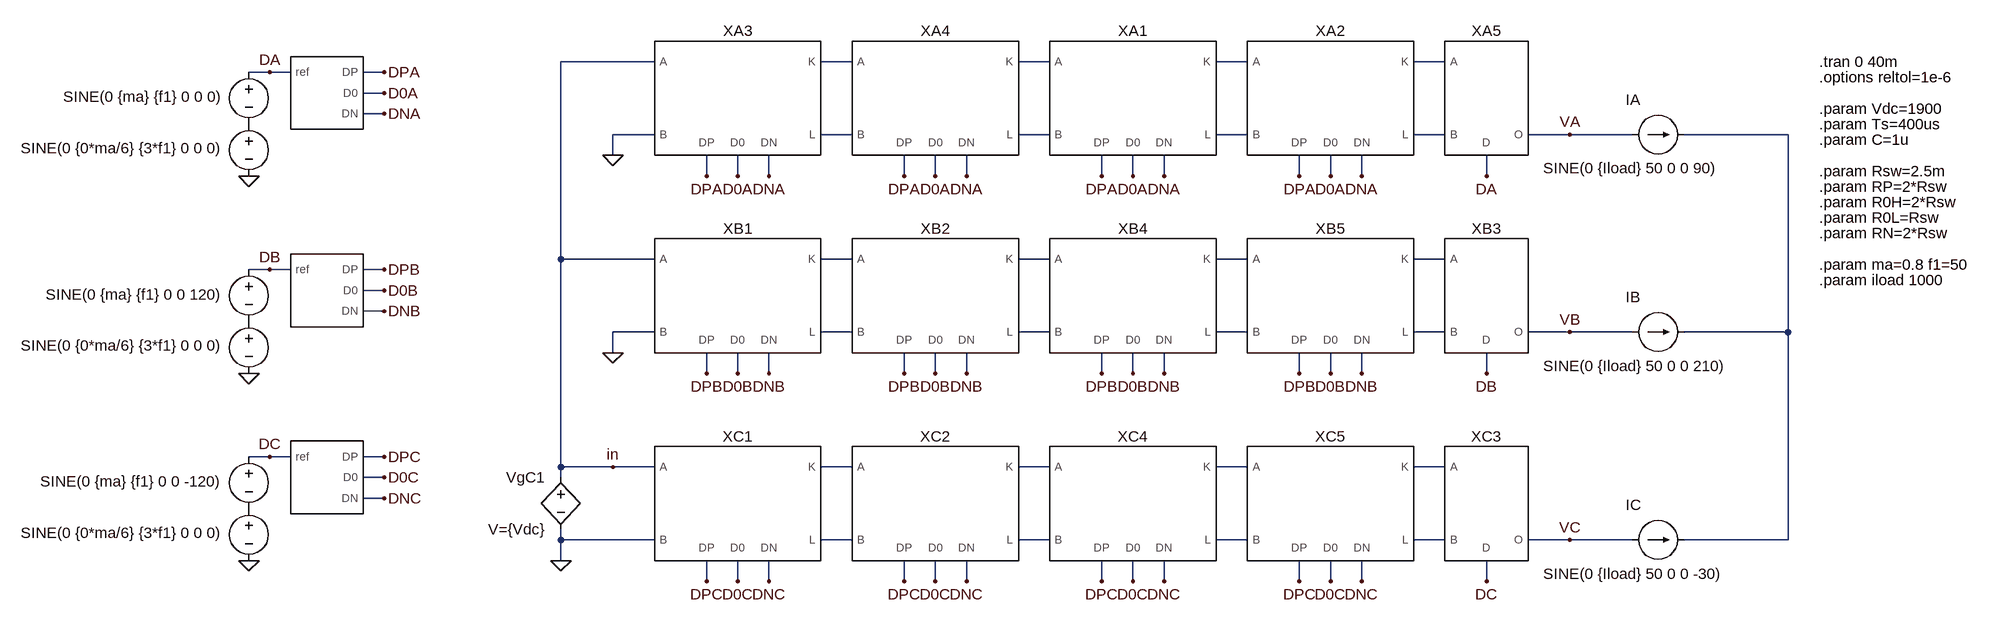
[diagram p0: schematic STATCOM.asc]
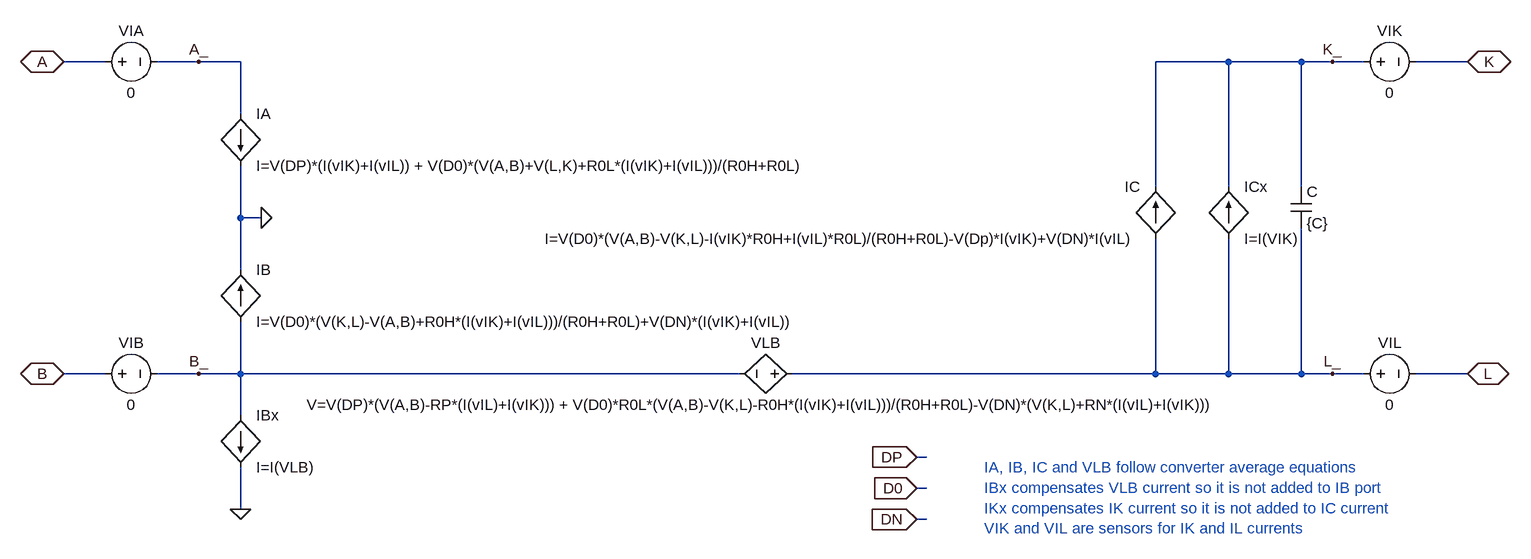
[diagram p1: sub-circuit pn_average_model.asc]
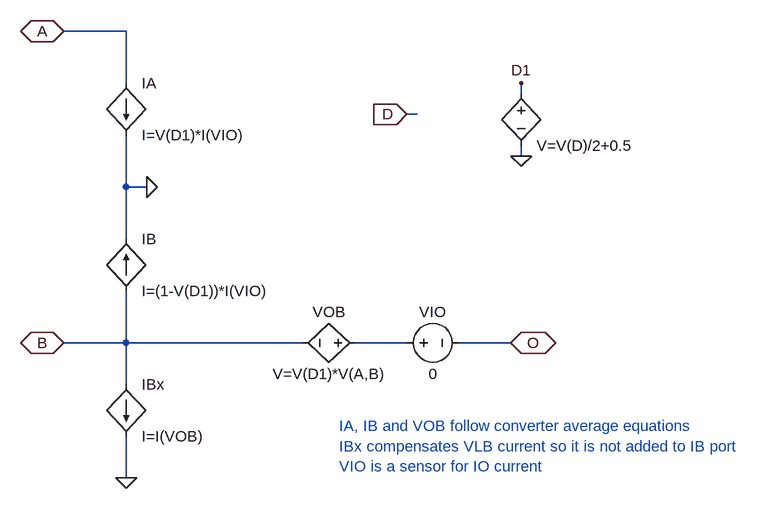
[diagram p2: sub-circuit 2l_average_model.asc]
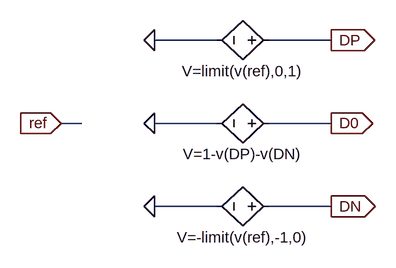
[diagram p3: sub-circuit pn_average_modulator.asc]
STATCOM.asc, the LTspice schematic file:
Version 4
SHEET 1 4356 1844
WIRE 1328 -672 1184 -672
WIRE 1632 -672 1584 -672
WIRE 1936 -672 1888 -672
WIRE 2240 -672 2192 -672
WIRE 2544 -672 2496 -672
WIRE 736 -656 704 -656
WIRE 768 -656 736 -656
WIRE 912 -656 880 -656
WIRE 912 -624 880 -624
WIRE 912 -592 880 -592
WIRE 1328 -560 1264 -560
WIRE 1632 -560 1584 -560
WIRE 1936 -560 1888 -560
WIRE 2240 -560 2192 -560
WIRE 2544 -560 2496 -560
WIRE 2736 -560 2672 -560
WIRE 2832 -560 2736 -560
WIRE 3072 -560 2912 -560
WIRE 1264 -528 1264 -560
WIRE 1408 -496 1408 -528
WIRE 1456 -496 1456 -528
WIRE 1504 -496 1504 -528
WIRE 1712 -496 1712 -528
WIRE 1760 -496 1760 -528
WIRE 1808 -496 1808 -528
WIRE 2016 -496 2016 -528
WIRE 2064 -496 2064 -528
WIRE 2112 -496 2112 -528
WIRE 2320 -496 2320 -528
WIRE 2368 -496 2368 -528
WIRE 2416 -496 2416 -528
WIRE 2608 -496 2608 -528
WIRE 1184 -368 1184 -672
WIRE 1328 -368 1184 -368
WIRE 1632 -368 1584 -368
WIRE 1936 -368 1888 -368
WIRE 2240 -368 2192 -368
WIRE 2544 -368 2496 -368
WIRE 736 -352 704 -352
WIRE 768 -352 736 -352
WIRE 912 -352 880 -352
WIRE 912 -320 880 -320
WIRE 912 -288 880 -288
WIRE 1328 -256 1264 -256
WIRE 1632 -256 1584 -256
WIRE 1936 -256 1888 -256
WIRE 2240 -256 2192 -256
WIRE 2544 -256 2496 -256
WIRE 2736 -256 2672 -256
WIRE 2832 -256 2736 -256
WIRE 3072 -256 3072 -560
WIRE 3072 -256 2912 -256
WIRE 1264 -224 1264 -256
WIRE 1408 -192 1408 -224
WIRE 1456 -192 1456 -224
WIRE 1504 -192 1504 -224
WIRE 1712 -192 1712 -224
WIRE 1760 -192 1760 -224
WIRE 1808 -192 1808 -224
WIRE 2016 -192 2016 -224
WIRE 2064 -192 2064 -224
WIRE 2112 -192 2112 -224
WIRE 2320 -192 2320 -224
WIRE 2368 -192 2368 -224
WIRE 2416 -192 2416 -224
WIRE 2608 -192 2608 -224
WIRE 736 -64 704 -64
WIRE 768 -64 736 -64
WIRE 912 -64 880 -64
WIRE 1184 -48 1184 -368
WIRE 1264 -48 1184 -48
WIRE 1328 -48 1264 -48
WIRE 1632 -48 1584 -48
WIRE 1936 -48 1888 -48
WIRE 2240 -48 2192 -48
WIRE 2544 -48 2496 -48
WIRE 912 -32 880 -32
WIRE 1184 -32 1184 -48
WIRE 912 0 880 0
WIRE 1184 64 1184 48
WIRE 1328 64 1184 64
WIRE 1632 64 1584 64
WIRE 1936 64 1888 64
WIRE 2240 64 2192 64
WIRE 2544 64 2496 64
WIRE 2736 64 2672 64
WIRE 2832 64 2736 64
WIRE 3072 64 3072 -256
WIRE 3072 64 2912 64
WIRE 1184 96 1184 64
WIRE 1408 128 1408 96
WIRE 1456 128 1456 96
WIRE 1504 128 1504 96
WIRE 1712 128 1712 96
WIRE 1760 128 1760 96
WIRE 1808 128 1808 96
WIRE 2016 128 2016 96
WIRE 2064 128 2064 96
WIRE 2112 128 2112 96
WIRE 2320 128 2320 96
WIRE 2368 128 2368 96
WIRE 2416 128 2416 96
WIRE 2608 128 2608 96
FLAG 912 -656 DPA
FLAG 912 -624 D0A
FLAG 912 -592 DNA
FLAG 1408 -496 DPA
FLAG 1456 -496 D0A
FLAG 1504 -496 DNA
FLAG 1264 -528 0
FLAG 1408 -192 DPB
FLAG 1456 -192 D0B
FLAG 1504 -192 DNB
FLAG 1264 -224 0
FLAG 1408 128 DPC
FLAG 1456 128 D0C
FLAG 1504 128 DNC
FLAG 1184 96 0
FLAG 704 -496 0
FLAG 1712 -496 DPA
FLAG 1760 -496 D0A
FLAG 1808 -496 DNA
FLAG 912 -352 DPB
FLAG 912 -320 D0B
FLAG 912 -288 DNB
FLAG 704 -192 0
FLAG 912 -64 DPC
FLAG 912 -32 D0C
FLAG 912 0 DNC
FLAG 704 96 0
FLAG 1712 -192 DPB
FLAG 1760 -192 D0B
FLAG 1808 -192 DNB
FLAG 1712 128 DPC
FLAG 1760 128 D0C
FLAG 1808 128 DNC
FLAG 736 -64 DC
FLAG 736 -352 DB
FLAG 736 -656 DA
FLAG 2608 -496 DA
FLAG 2608 -192 DB
FLAG 2608 128 DC
FLAG 2736 -560 VA
FLAG 2736 -256 VB
FLAG 2736 64 VC
FLAG 2016 -496 DPA
FLAG 2064 -496 D0A
FLAG 2112 -496 DNA
FLAG 2016 -192 DPB
FLAG 2064 -192 D0B
FLAG 2112 -192 DNB
FLAG 2016 128 DPC
FLAG 2064 128 D0C
FLAG 2112 128 DNC
FLAG 2320 -496 DPA
FLAG 2368 -496 D0A
FLAG 2416 -496 DNA
FLAG 2320 -192 DPB
FLAG 2368 -192 D0B
FLAG 2416 -192 DNB
FLAG 2320 128 DPC
FLAG 2368 128 D0C
FLAG 2416 128 DNC
FLAG 1264 -48 in
SYMBOL PN_average_model 1456 -624 R0
SYMATTR InstName XA3
SYMATTR SpiceLine C={4*C} RP={RP/4} R0H={R0H/4} R0L={R0L/4} RN={RN/4}
SYMBOL PN_average_model 1760 -624 R0
SYMATTR InstName XA4
SYMATTR SpiceLine C={3*C} RP={RP/3} R0H={R0H/3} R0L={R0L/3} RN={RN/3}
SYMBOL PN_average_model 1456 -320 R0
SYMATTR InstName XB1
SYMATTR SpiceLine C={4*C} RP={RP/4} R0H={R0H/4} R0L={R0L/4} RN={RN/4}
SYMBOL PN_average_model 1760 -320 R0
SYMATTR InstName XB2
SYMATTR SpiceLine C={3*C} RP={RP/3} R0H={R0H/3} R0L={R0L/3} RN={RN/3}
SYMBOL bv 1184 -48 M0
SYMATTR InstName VgC1
SYMATTR Value V={Vdc}
SYMBOL PN_average_model 1456 0 R0
SYMATTR InstName XC1
SYMATTR SpiceLine C={4*C} RP={RP/4} R0H={R0H/4} R0L={R0L/4} RN={RN/4}
SYMBOL PN_average_model 1760 0 R0
SYMATTR InstName XC2
SYMATTR SpiceLine C={3*C} RP={RP/3} R0H={R0H/3} R0L={R0L/3} RN={RN/3}
SYMBOL voltage 704 -672 M0
WINDOW 0 24 16 Invisible 2
WINDOW 3 39 54 Left 2
SYMATTR InstName V2
SYMATTR Value SINE(0 {ma} {f1} 0 0 0)
SYMBOL voltage 704 -592 M0
WINDOW 0 24 16 Invisible 2
WINDOW 3 39 53 Left 2
SYMATTR InstName V3
SYMATTR Value SINE(0 {0*ma/6} {3*f1} 0 0 0)
SYMBOL voltage 704 -368 M0
WINDOW 0 24 16 Invisible 2
WINDOW 3 39 54 Left 2
SYMATTR InstName V4
SYMATTR Value SINE(0 {ma} {f1} 0 0 120)
SYMBOL voltage 704 -288 M0
WINDOW 0 24 16 Invisible 2
WINDOW 3 39 53 Left 2
SYMATTR InstName V5
SYMATTR Value SINE(0 {0*ma/6} {3*f1} 0 0 0)
SYMBOL voltage 704 -80 M0
WINDOW 0 24 16 Invisible 2
WINDOW 3 39 54 Left 2
SYMATTR InstName V6
SYMATTR Value SINE(0 {ma} {f1} 0 0 -120)
SYMBOL voltage 704 0 M0
WINDOW 0 24 16 Invisible 2
WINDOW 3 39 53 Left 2
SYMATTR InstName V8
SYMATTR Value SINE(0 {0*ma/6} {3*f1} 0 0 0)
SYMBOL 2L_average_model 2608 -640 R0
SYMATTR InstName XA5
SYMBOL 2L_average_model 2608 -336 R0
SYMATTR InstName XB3
SYMBOL 2L_average_model 2608 -16 R0
SYMATTR InstName XC3
SYMBOL PN_average_modulator 816 -624 R0
WINDOW 0 8 -56 Invisible 2
SYMATTR InstName X1
SYMBOL PN_average_modulator 816 -320 R0
WINDOW 0 8 -56 Invisible 2
SYMATTR InstName X3
SYMBOL PN_average_modulator 816 -32 R0
WINDOW 0 8 -56 Invisible 2
SYMATTR InstName X4
SYMBOL current 2832 -560 M90
WINDOW 123 0 0 Left 2
WINDOW 39 0 0 Left 2
WINDOW 3 52 -137 VRight 2
WINDOW 0 -54 -10 VRight 2
SYMATTR Value SINE(0 {Iload} 50 0 0 90)
SYMATTR InstName IA
SYMBOL current 2832 -256 M90
WINDOW 123 0 0 Left 2
WINDOW 39 0 0 Left 2
WINDOW 3 52 -137 VRight 2
WINDOW 0 -54 -10 VRight 2
SYMATTR Value SINE(0 {Iload} 50 0 0 210)
SYMATTR InstName IB
SYMBOL current 2832 64 M90
WINDOW 123 0 0 Left 2
WINDOW 39 0 0 Left 2
WINDOW 3 52 -137 VRight 2
WINDOW 0 -54 -10 VRight 2
SYMATTR Value SINE(0 {Iload} 50 0 0 -30)
SYMATTR InstName IC
SYMBOL PN_average_model 2064 -624 R0
SYMATTR InstName XA1
SYMATTR SpiceLine C={2*C} RP={RP/2} R0H={R0H/2} R0L={R0L/2} RN={RN/2}
SYMBOL PN_average_model 2368 -624 R0
SYMATTR InstName XA2
SYMATTR SpiceLine C={C} RP={RP} R0H={R0H} R0L={R0L} RN={RN}
SYMBOL PN_average_model 2064 -320 R0
SYMATTR InstName XB4
SYMATTR SpiceLine C={2*C} RP={RP/2} R0H={R0H/2} R0L={R0L/2} RN={RN/2}
SYMBOL PN_average_model 2368 -320 R0
SYMATTR InstName XB5
SYMATTR SpiceLine C={C} RP={RP} R0H={R0H} R0L={R0L} RN={RN}
SYMBOL PN_average_model 2064 0 R0
SYMATTR InstName XC4
SYMATTR SpiceLine C={2*C} RP={RP/2} R0H={R0H/2} R0L={R0L/2} RN={RN/2}
SYMBOL PN_average_model 2368 0 R0
SYMATTR InstName XC5
SYMATTR SpiceLine C={C} RP={RP} R0H={R0H} R0L={R0L} RN={RN}
TEXT 3120 -576 Left 2 !.param Ts=400us
TEXT 3120 -672 Left 2 !.tran 0 40m
TEXT 3120 -600 Left 2 !.param Vdc=1900
TEXT 3120 -360 Left 2 !.param ma=0.8 f1=50
TEXT 3120 -504 Left 2 !.param Rsw=2.5m
TEXT 3120 -480 Left 2 !.param RP=2*Rsw
TEXT 3120 -408 Left 2 !.param RN=2*Rsw
TEXT 3120 -456 Left 2 !.param R0H=2*Rsw
TEXT 3120 -432 Left 2 !.param R0L=Rsw
TEXT 3120 -552 Left 2 !.param C=1u
TEXT 3120 -648 Left 2 !.options reltol=1e-6
TEXT 3120 -336 Left 2 !.param iload 1000

pn_average_model.asc, the sub-circuit schematic file:
Version 4
SHEET 1 2060 780
WIRE -720 16 -784 16
WIRE -576 16 -640 16
WIRE -512 16 -576 16
WIRE 1008 16 896 16
WIRE 1120 16 1008 16
WIRE 1168 16 1120 16
WIRE 1216 16 1168 16
WIRE 1376 16 1296 16
WIRE -512 96 -512 16
WIRE 896 208 896 16
WIRE 1008 208 1008 16
WIRE 1120 208 1120 16
WIRE -512 256 -512 176
WIRE -480 256 -512 256
WIRE -512 336 -512 256
WIRE -720 496 -784 496
WIRE -576 496 -640 496
WIRE -512 496 -512 416
WIRE -512 496 -576 496
WIRE 256 496 -512 496
WIRE 896 496 896 288
WIRE 896 496 336 496
WIRE 1008 496 1008 288
WIRE 1008 496 896 496
WIRE 1120 496 1120 272
WIRE 1120 496 1008 496
WIRE 1168 496 1120 496
WIRE 1216 496 1168 496
WIRE 1376 496 1296 496
WIRE -512 560 -512 496
WIRE 544 624 528 624
WIRE 544 672 528 672
WIRE -512 704 -512 640
WIRE 544 720 528 720
FLAG 1376 16 K
IOPIN 1376 16 BiDir
FLAG 1376 496 L
IOPIN 1376 496 BiDir
FLAG -784 16 A
IOPIN -784 16 BiDir
FLAG -784 496 B
IOPIN -784 496 BiDir
FLAG 528 624 DP
IOPIN 528 624 In
FLAG 528 672 D0
IOPIN 528 672 In
FLAG 528 720 DN
IOPIN 528 720 In
FLAG -480 256 0
FLAG -512 704 0
FLAG -576 16 A_
FLAG -576 496 B_
FLAG 1168 16 K_
FLAG 1168 496 L_
SYMBOL bv 352 496 R90
WINDOW 0 -32 56 VBottom 2
WINDOW 3 32 56 VTop 2
SYMATTR InstName VLB
SYMATTR Value V=V(DP)*(V(A,B)-RP*(I(vIL)+I(vIK))) + V(D0)*R0L*(V(A,B)-V(K,L)-R0H*(I(vIK)+I(vIL)))/(R0H+R0L)-V(DN)*(V(K,L)+RN*(I(vIL)+I(vIK)))
SYMBOL bi -512 96 R0
SYMATTR InstName IA
SYMATTR Value I=V(DP)*(I(vIK)+I(vIL)) + V(D0)*(V(A,B)+V(L,K)+R0L*(I(vIK)+I(vIL)))/(R0H+R0L)
SYMBOL cap 1104 208 R0
SYMATTR InstName C
SYMATTR Value {C}
SYMBOL bi 896 288 R180
WINDOW 0 24 80 Left 2
WINDOW 3 24 0 Left 2
SYMATTR InstName IC
SYMATTR Value I=V(D0)*(V(A,B)-V(K,L)-I(vIK)*R0H+I(vIL)*R0L)/(R0H+R0L)-V(Dp)*I(vIK)+V(DN)*I(vIL)
SYMBOL bi -512 416 M180
WINDOW 0 24 80 Left 2
WINDOW 3 24 0 Left 2
SYMATTR InstName IB
SYMATTR Value I=V(D0)*(V(K,L)-V(A,B)+R0H*(I(vIK)+I(vIL)))/(R0H+R0L)+V(DN)*(I(vIK)+I(vIL))
SYMBOL voltage 1200 496 R270
WINDOW 0 32 56 VTop 2
WINDOW 3 -32 56 VBottom 2
SYMATTR InstName VIL
SYMATTR Value 0
SYMBOL voltage 1200 16 R270
WINDOW 0 32 56 VTop 2
WINDOW 3 -32 56 VBottom 2
SYMATTR InstName VIK
SYMATTR Value 0
SYMBOL bi -512 560 R0
SYMATTR InstName IBx
SYMATTR Value I=I(VLB)
SYMBOL bi 1008 288 M180
WINDOW 0 24 80 Left 2
WINDOW 3 24 0 Left 2
SYMATTR InstName ICx
SYMATTR Value I=I(VIK)
SYMBOL voltage -736 496 R270
WINDOW 0 32 56 VTop 2
WINDOW 3 -32 56 VBottom 2
SYMATTR InstName VIB
SYMATTR Value 0
SYMBOL voltage -736 16 R270
WINDOW 0 32 56 VTop 2
WINDOW 3 -32 56 VBottom 2
SYMATTR InstName VIA
SYMATTR Value 0
TEXT 632 640 Left 2 ;IA, IB, IC and VLB follow converter average equations\nIBx compensates VLB current so it is not added to IB port\nIKx compensates IK current so it is not added to IC current\nVIK and VIL are sensors for IK and IL currents

2l_average_model.asc, the sub-circuit schematic file:
Version 4
SHEET 1 2060 780
WIRE -512 16 -608 16
WIRE -512 96 -512 16
WIRE 96 112 96 96
WIRE -64 144 -80 144
WIRE 96 208 96 192
WIRE -512 256 -512 176
WIRE -480 256 -512 256
WIRE -512 336 -512 256
WIRE -512 496 -512 416
WIRE -512 496 -608 496
WIRE -240 496 -512 496
WIRE -80 496 -160 496
WIRE 80 496 0 496
WIRE -512 560 -512 496
WIRE -512 704 -512 640
FLAG 80 496 O
IOPIN 80 496 BiDir
FLAG -608 16 A
IOPIN -608 16 BiDir
FLAG -608 496 B
IOPIN -608 496 BiDir
FLAG -80 144 D
IOPIN -80 144 In
FLAG -480 256 0
FLAG -512 704 0
FLAG 96 208 0
FLAG 96 96 D1
SYMBOL bv -144 496 R90
WINDOW 0 -32 56 VBottom 2
WINDOW 3 32 56 VTop 2
SYMATTR InstName VOB
SYMATTR Value V=V(D1)*V(A,B)
SYMBOL bi -512 96 R0
SYMATTR InstName IA
SYMATTR Value I=V(D1)*I(VIO)
SYMBOL bi -512 416 M180
WINDOW 0 24 80 Left 2
WINDOW 3 24 0 Left 2
SYMATTR InstName IB
SYMATTR Value I=(1-V(D1))*I(VIO)
SYMBOL voltage -96 496 R270
WINDOW 0 32 56 VTop 2
WINDOW 3 -32 56 VBottom 2
SYMATTR InstName VIO
SYMATTR Value 0
SYMBOL bi -512 560 R0
SYMATTR InstName IBx
SYMATTR Value I=I(VOB)
SYMBOL bv 96 96 R0
WINDOW 0 24 16 Invisible 2
SYMATTR InstName VD
SYMATTR Value V=V(D)/2+0.5
TEXT -184 624 Left 2 ;IA, IB and VOB follow converter average equations\nIBx compensates VLB current so it is not added to IB port\nVIO is a sensor for IO current

pn_average_modulator.asc, the sub-circuit schematic file:
Version 4
SHEET 1 880 680
WIRE 304 160 208 160
WIRE 480 160 384 160
WIRE 96 288 64 288
WIRE 304 288 208 288
WIRE 480 288 384 288
WIRE 304 416 208 416
WIRE 480 416 384 416
FLAG 208 160 0
FLAG 208 288 0
FLAG 208 416 0
FLAG 480 160 DP
IOPIN 480 160 Out
FLAG 480 288 D0
IOPIN 480 288 Out
FLAG 480 416 DN
IOPIN 480 416 Out
FLAG 64 288 ref
IOPIN 64 288 In
SYMBOL bv 400 160 R90
WINDOW 0 -32 56 Invisible 2
WINDOW 3 32 56 VTop 2
SYMATTR InstName Bpos1
SYMATTR Value V=limit(v(ref),0,1)
SYMBOL bv 400 288 R90
WINDOW 0 -32 56 Invisible 2
WINDOW 3 32 56 VTop 2
SYMATTR InstName Bzero1
SYMATTR Value V=1-v(DP)-v(DN)
SYMBOL bv 400 416 R90
WINDOW 0 -32 56 Invisible 2
WINDOW 3 32 56 VTop 2
SYMATTR InstName Bneg1
SYMATTR Value V=-limit(v(ref),-1,0)

The netlist it stands for:
* STATCOM.asc
XXA3 D0A DNA DPA in 0 N001 N005 pn_average_model params: C={4*C} RP={RP/4} R0H={R0H/4} R0L={R0L/4} RN={RN/4}
XXA4 D0A DNA DPA N001 N005 N002 N006 pn_average_model params: C={3*C} RP={RP/3} R0H={R0H/3} R0L={R0L/3} RN={RN/3}
XXB1 D0B DNB DPB in 0 N010 N014 pn_average_model params: C={4*C} RP={RP/4} R0H={R0H/4} R0L={R0L/4} RN={RN/4}
XXB2 D0B DNB DPB N010 N014 N011 N015 pn_average_model params: C={3*C} RP={RP/3} R0H={R0H/3} R0L={R0L/3} RN={RN/3}
B§VgC1 in 0 V={Vdc}
XXC1 D0C DNC DPC in 0 N018 N022 pn_average_model params: C={4*C} RP={RP/4} R0H={R0H/4} R0L={R0L/4} RN={RN/4}
XXC2 D0C DNC DPC N018 N022 N019 N023 pn_average_model params: C={3*C} RP={RP/3} R0H={R0H/3} R0L={R0L/3} RN={RN/3}
V2 DA P001 SINE(0 {ma} {f1} 0 0 0)
V3 P001 0 SINE(0 {0*ma/6} {3*f1} 0 0 0)
V4 DB P002 SINE(0 {ma} {f1} 0 0 120)
V5 P002 0 SINE(0 {0*ma/6} {3*f1} 0 0 0)
V6 DC P003 SINE(0 {ma} {f1} 0 0 -120)
V8 P003 0 SINE(0 {0*ma/6} {3*f1} 0 0 0)
XXA5 DA N004 N008 VA 2l_average_model
XXB3 DB N013 N017 VB 2l_average_model
XXC3 DC N021 N025 VC 2l_average_model
XX1 DA D0A DNA DPA pn_average_modulator
XX3 DB D0B DNB DPB pn_average_modulator
XX4 DC D0C DNC DPC pn_average_modulator
IA VA N009 SINE(0 {Iload} 50 0 0 90)
IB VB N009 SINE(0 {Iload} 50 0 0 210)
IC VC N009 SINE(0 {Iload} 50 0 0 -30)
XXA1 D0A DNA DPA N002 N006 N003 N007 pn_average_model params: C={2*C} RP={RP/2} R0H={R0H/2} R0L={R0L/2} RN={RN/2}
XXA2 D0A DNA DPA N003 N007 N004 N008 pn_average_model params: C={C} RP={RP} R0H={R0H} R0L={R0L} RN={RN}
XXB4 D0B DNB DPB N011 N015 N012 N016 pn_average_model params: C={2*C} RP={RP/2} R0H={R0H/2} R0L={R0L/2} RN={RN/2}
XXB5 D0B DNB DPB N012 N016 N013 N017 pn_average_model params: C={C} RP={RP} R0H={R0H} R0L={R0L} RN={RN}
XXC4 D0C DNC DPC N019 N023 N020 N024 pn_average_model params: C={2*C} RP={RP/2} R0H={R0H/2} R0L={R0L/2} RN={RN/2}
XXC5 D0C DNC DPC N020 N024 N021 N025 pn_average_model params: C={C} RP={RP} R0H={R0H} R0L={R0L} RN={RN}

* block symbol definitions
.subckt pn_average_model D0 DN DP A B K L
B§VLB L_ B_ V=V(DP)*(V(A,B)-RP*(I(vIL)+I(vIK))) + V(D0)*R0L*(V(A,B)-V(K,L)-R0H*(I(vIK)+I(vIL)))/(R0H+R0L)-V(DN)*(V(K,L)+RN*(I(vIL)+I(vIK)))
B§IA A_ 0 I=V(DP)*(I(vIK)+I(vIL)) + V(D0)*(V(A,B)+V(L,K)+R0L*(I(vIK)+I(vIL)))/(R0H+R0L)
C K_ L_ {C}
B§IC L_ K_ I=V(D0)*(V(A,B)-V(K,L)-I(vIK)*R0H+I(vIL)*R0L)/(R0H+R0L)-V(Dp)*I(vIK)+V(DN)*I(vIL)
B§IB B_ 0 I=V(D0)*(V(K,L)-V(A,B)+R0H*(I(vIK)+I(vIL)))/(R0H+R0L)+V(DN)*(I(vIK)+I(vIL))
VIL L_ L 0
VIK K_ K 0
B§IBx B_ 0 I=I(VLB)
B§ICx L_ K_ I=I(VIK)
VIB B B_ 0
VIA A A_ 0
* IA, IB, IC and VLB follow converter average equations
* IBx compensates VLB current so it is not added to IB port
* IKx compensates IK current so it is not added to IC current
* VIK and VIL are sensors for IK and IL currents
.ends pn_average_model

.subckt 2l_average_model D A B O
B§VOB N001 B V=V(D1)*V(A,B)
B§IA A 0 I=V(D1)*I(VIO)
B§IB B 0 I=(1-V(D1))*I(VIO)
VIO N001 O 0
B§IBx B 0 I=I(VOB)
B§VD D1 0 V=V(D)/2+0.5
* IA, IB and VOB follow converter average equations
* IBx compensates VLB current so it is not added to IB port
* VIO is a sensor for IO current
.ends 2l_average_model

.subckt pn_average_modulator ref D0 DN DP
Bpos1 DP 0 V=limit(v(ref),0,1)
Bzero1 D0 0 V=1-v(DP)-v(DN)
Bneg1 DN 0 V=-limit(v(ref),-1,0)
.ends pn_average_modulator

.param Ts=400us
.tran 0 40m
.param Vdc=1900
.param ma=0.8 f1=50
.param Rsw=2.5m
.param RP=2*Rsw
.param RN=2*Rsw
.param R0H=2*Rsw
.param R0L=Rsw
.param C=1u
.options reltol=1e-6
.param iload 1000
.backanno
.end